# Altium schematic sheet hierarchy.SchDoc
size Letter; Organization: UW Robotics; Address1: 200 University Avenue; Address2: Waterloo; Address3: Ontario; Address4: Canada N2L 3G6
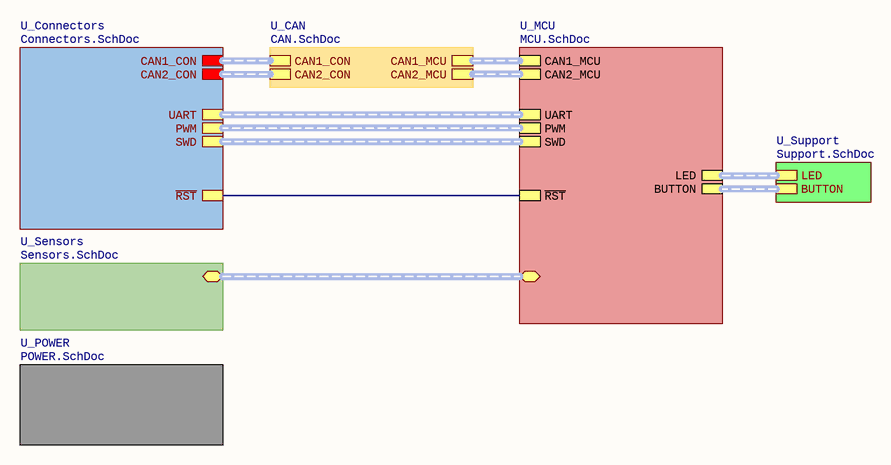
[diagram p0: hierarchy.SchDoc]

## Sub-sheets
U_CAN = CAN.SchDoc: CAN1_CON (harness CAN1), CAN2_CON (harness CAN2), CAN2_MCU (harness CAN2_MCU), CAN1_MCU (harness CAN1_MCU)
U_Connectors = Connectors.SchDoc: ~{RST}, CAN1_CON (harness CAN1), CAN2_CON (harness CAN2), UART (harness UART), PWM (harness PWM), SWD (harness SWD)
U_MCU = MCU.SchDoc: ~{RST}, UART (harness UART), CAN1_MCU (harness CAN1_MCU), CAN2_MCU (harness CAN2_MCU), LED (harness LED), SWD (harness SWD), BUTTON (harness BUTTON), PWM (harness PWM),  (bidir)
U_POWER = POWER.SchDoc: no entries
U_Sensors = Sensors.SchDoc:  (bidir)
U_Support = Support.SchDoc: LED (harness LED), BUTTON (harness BUTTON)

## Nets
(unnamed): sheet U_Connectors/~{RST}, sheet U_MCU/~{RST}

## Buses and harness runs
harness sheet U_CAN/CAN1_CON = sheet U_Connectors/CAN1_CON
harness sheet U_CAN/CAN1_MCU = sheet U_MCU/CAN1_MCU
harness sheet U_CAN/CAN2_CON = sheet U_Connectors/CAN2_CON
harness sheet U_CAN/CAN2_MCU = sheet U_MCU/CAN2_MCU
harness sheet U_Connectors/PWM = sheet U_MCU/PWM
harness sheet U_Connectors/SWD = sheet U_MCU/SWD
harness sheet U_Connectors/UART = sheet U_MCU/UART
harness sheet U_MCU/ = sheet U_Sensors/
harness sheet U_MCU/BUTTON = sheet U_Support/BUTTON
harness sheet U_MCU/LED = sheet U_Support/LED

## Notes on the sheet
- Title
- Size:
- Date:
- Letter
- Drawn By:
- Sheet
- of
- File: